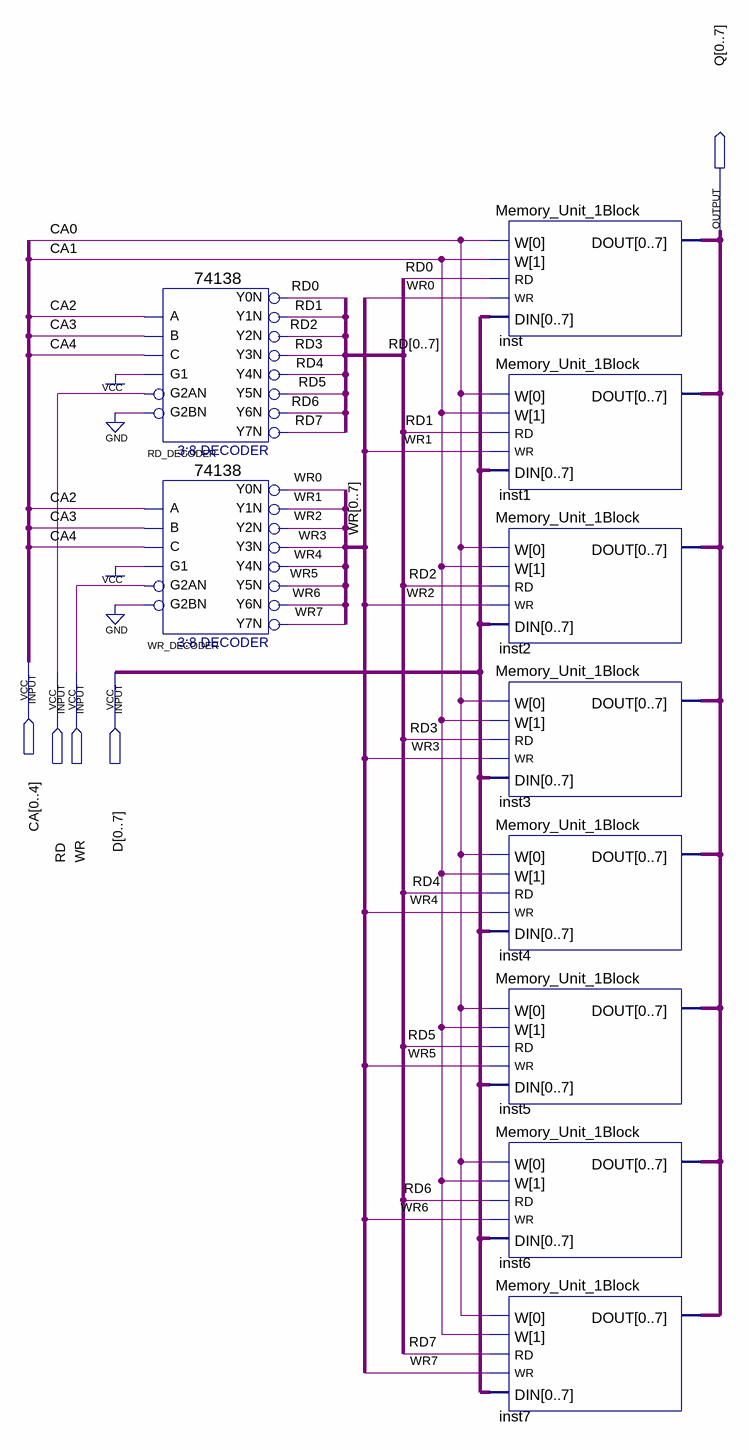
[diagram p0: schematic sheet]
// Quartus schematic Memory_Unit_8Blocks.bdf as structural Verilog: 10 symbols, 5 pins
module Memory_Unit_8Blocks (
  input  [0:4] CA,
  input  RD,
  input  WR,
  input  [0:7] D,
  output [0:7] Q
);

  wire [7:0] RD_bus, WR_bus;

  \74138  RD_DECODER (
    .A(CA[2]), .B(CA[3]), .G1(1'b1), .C(CA[4]), .G2AN(RD), .G2BN(1'b0), .Y0N(RD_bus[0]), .Y1N(RD_bus[1]),
    .Y2N(RD_bus[2]), .Y3N(RD_bus[3]), .Y4N(RD_bus[4]), .Y5N(RD_bus[5]), .Y6N(RD_bus[6]), .Y7N(RD_bus[7]));
  \74138  WR_DECODER (
    .A(CA[2]), .B(CA[3]), .G1(1'b1), .C(CA[4]), .G2AN(WR), .G2BN(1'b0), .Y0N(WR_bus[0]), .Y1N(WR_bus[1]),
    .Y2N(WR_bus[2]), .Y3N(WR_bus[3]), .Y4N(WR_bus[4]), .Y5N(WR_bus[5]), .Y6N(WR_bus[6]), .Y7N(WR_bus[7]));
  Memory_Unit_1Block inst (.W({CA[1], CA[0]}), .RD(RD_bus[0]), .WR(WR_bus[0]), .DIN(D), .DOUT(Q));
  Memory_Unit_1Block inst1 (.W({CA[1], CA[0]}), .RD(RD_bus[1]), .WR(WR_bus[1]), .DIN(D), .DOUT(Q));
  Memory_Unit_1Block inst2 (.W({CA[1], CA[0]}), .RD(RD_bus[2]), .WR(WR_bus[2]), .DIN(D), .DOUT(Q));
  Memory_Unit_1Block inst3 (.W({CA[1], CA[0]}), .RD(RD_bus[3]), .WR(WR_bus[3]), .DIN(D), .DOUT(Q));
  Memory_Unit_1Block inst4 (.W({CA[1], CA[0]}), .RD(RD_bus[4]), .WR(WR_bus[4]), .DIN(D), .DOUT(Q));
  Memory_Unit_1Block inst5 (.W({CA[1], CA[0]}), .RD(RD_bus[5]), .WR(WR_bus[5]), .DIN(D), .DOUT(Q));
  Memory_Unit_1Block inst6 (.W({CA[1], CA[0]}), .RD(RD_bus[6]), .WR(WR_bus[6]), .DIN(D), .DOUT(Q));
  Memory_Unit_1Block inst7 (.W({CA[1], CA[0]}), .RD(RD_bus[7]), .WR(WR_bus[7]), .DIN(D), .DOUT(Q));
endmodule
